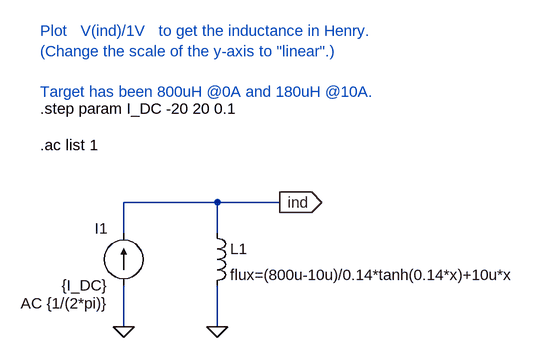
[diagram p0: schematic nonlin_inductor_tanh1.asc]
nonlin_inductor_tanh1.asc, the LTspice schematic file:
Version 4
SHEET 1 1260 680
WIRE -16 80 -16 32
WIRE -16 224 -16 160
WIRE 128 32 -16 32
WIRE 128 80 128 32
WIRE 128 224 128 160
WIRE 224 32 128 32
FLAG -16 224 0
FLAG 128 224 0
FLAG 224 32 ind
IOPIN 224 32 Out
SYMBOL current -16 160 R180
WINDOW 0 24 88 Left 0
WINDOW 3 24 0 Left 0
WINDOW 123 24 -28 Left 0
WINDOW 39 0 0 Left 0
SYMATTR InstName I1
SYMATTR Value {I_DC}
SYMATTR Value2 AC {1/(2*pi)}
SYMBOL ind 112 64 R0
SYMATTR InstName L1
SYMATTR Value flux=(800u-10u)/0.14*tanh(0.14*x)+10u*x
SYMATTR SpiceLine Rser=1e-9
TEXT -144 -56 Left 0 !.ac list 1
TEXT -144 -112 Left 0 !.step param I_DC -20 20 0.1
TEXT -144 -232 Left 0 ;Plot   V(ind)/1V   to get the inductance in Henry.\n(Change the scale of the y-axis to "linear".)\n \nTarget has been 800uH @0A and 180uH @10A.

The netlist it stands for:
* nonlin_inductor_tanh1.asc
I1 0 ind {I_DC} AC {1/(2*pi)}
L1 ind 0 flux=(800u-10u)/0.14*tanh(0.14*x)+10u*x Rser=1e-9
.ac list 1
.step param I_DC -20 20 0.1
* Plot   V(ind)/1V   to get the inductance in Henry.
* (Change the scale of the y-axis to "linear".)
* Target has been 800uH @0A and 180uH @10A.
.backanno
.end